# Altium project phun_suong.PrjPcb
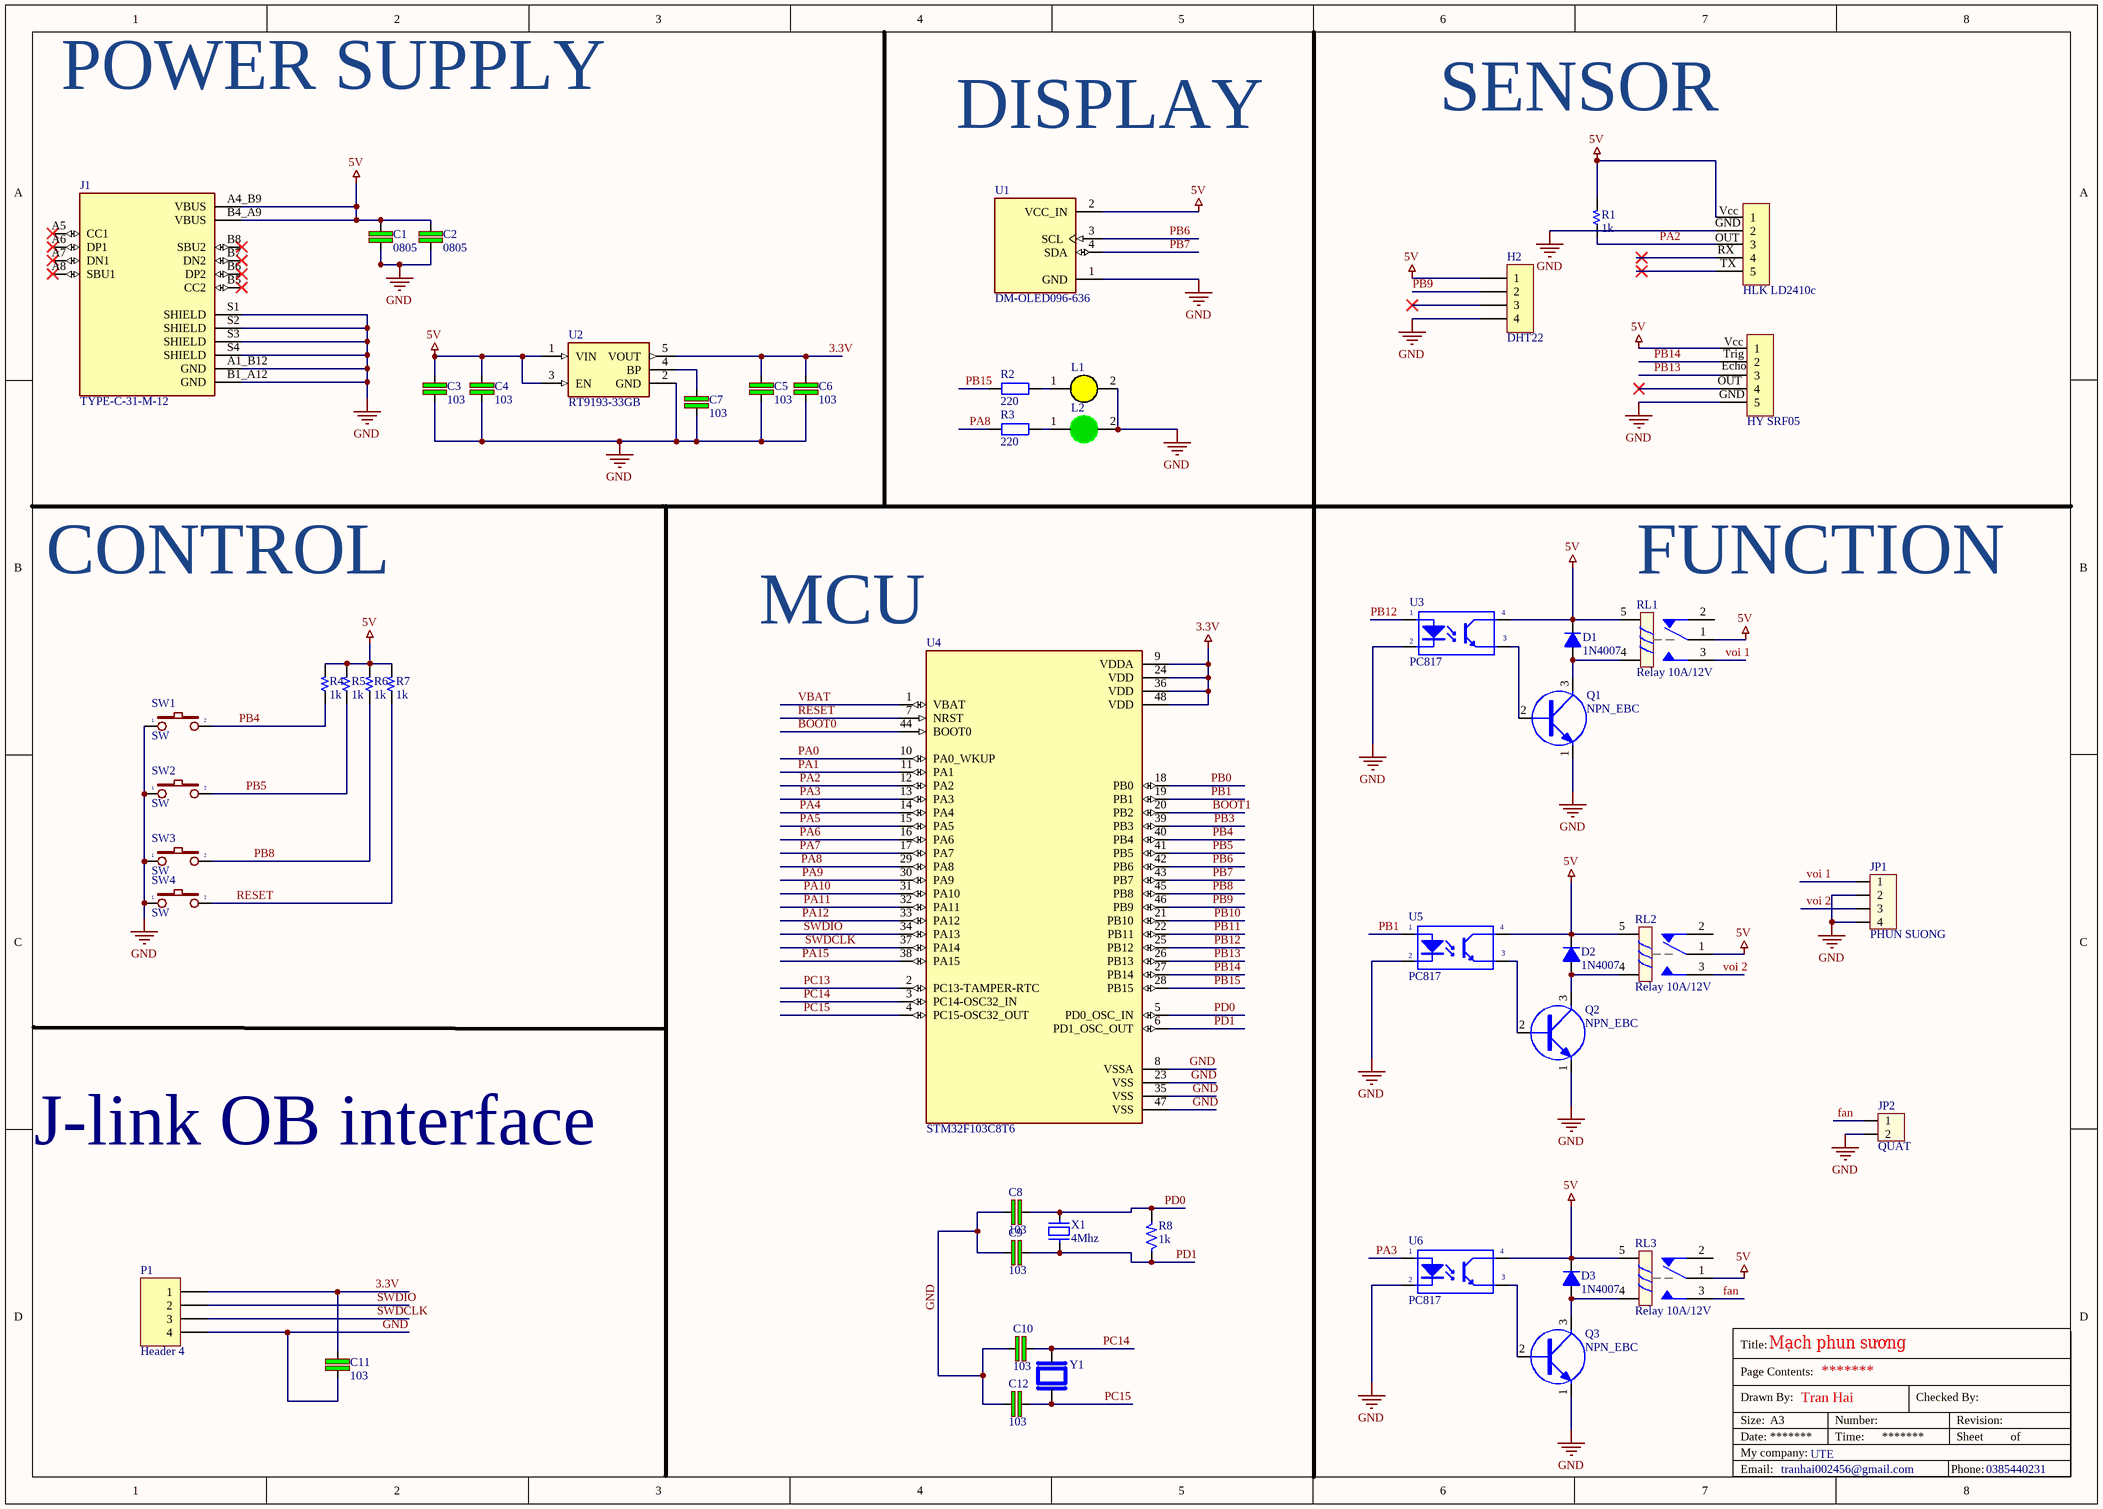
[diagram p0: main.SchDoc]
1 sheet, 50 parts. Net scope: global (net labels, ports and power ports of the same name join across sheets).
Board files: PCB1.PcbDoc, PCB2.PcbDoc, PCB3.PcbDoc, PCB4.PcbDoc

## Sheet main.SchDoc: Title
size A3; Date: *******; ApprovedBy: *******; CheckedBy: None; Author: *******; CompanyName: *******; DrawnBy: Name; Engineer: *******; Organization: *******; Address1: *******; Address2: *******; Address3: *******; Address4: *******; DocumentNumber: Doc Num; Revision: *******; SheetNumber: 1; SheetTotal: 1; CurrentTime: *******; CurrentDate: *******; Time: *******; DocumentFullPathAndName: *******; DocumentName: *******; ModifiedDate: *******; ImagePath: *******; ProjectName: *******; Application_BuildNumber: *******

### Parts
C1  0805  [C-0805]
C2  0805  [C-0805]
C3  103  [C-0805]
C4  103  [C-0805]
C5  103  [C-0805]
C6  103  [C-0805]
C7  103  [C-0805]
C8  103  [C-0805]
C9  103  [C-0805]
C10  103  [C-0805]
C11  103  [C-0805]
C12  103  [C-0805]
D1  1N4007  [D1A]
D2  1N4007  [D1A]
D3  1N4007  [D1A]
H1  HLK LD2410c  [Header 5P DC 2.54]
H2  DHT22  [XH2.54M-4]
H3  HY SRF05  [XH2.54M-5]
J1  TYPE-C-31-M-12  [HRO_TYPE-C-31-M-12]
JP1  PHUN SUONG  [CON4]
JP2  QUAT  [CON2]
L1  LED 0805  [LED-0805-Yellow]  (value not drawn)
L2  LED 0805  [LED-0805-Green]  (value not drawn)
P1  Header 4  [HDR1X4]
Q1  NPN_EBC  [QTO-92]
Q2  NPN_EBC  [QTO-92]
Q3  NPN_EBC  [QTO-92]
R1  1k  [TRO SMD 0603]
R2  220  [tro smd 0603]
R3  220  [tro smd 0603]
R4  1k  [TRO SMD 0603]
R5  1k  [TRO SMD 0603]
R6  1k  [TRO SMD 0603]
R7  1k  [TRO SMD 0603]
R8  1k  [SM-1206]
RL1  Relay 10A/12V  [RL_SPDT_10A]
RL2  Relay 10A/12V  [RL_SPDT_10A]
RL3  Relay 10A/12V  [RL_SPDT_10A]
SW1  SW  [SW2]
SW2  SW  [SW2]
SW3  SW  [SW2]
SW4  SW  [SW2]
U1  DM-OLED096-636  [MODULE_DM-OLED096-636]
U2  RT9193-33GB  [SOT94P279X129-5N]
U3  PC817  [DIP4/W0.3]
U4  STM32F103C8T6  [QFP50P900X900X160-48N]
U5  PC817  [DIP4/W0.3]
U6  PC817  [DIP4/W0.3]
X1  4Mhz  [XT2]
Y1  ABS07-32.768KHZ-T  [XTAL_ABS07-32.768KHZ-T]  (value not drawn)

### Nets
3.3V: C5.2 C6.2 C11.2 P1.1 U2.5(VOUT) U4.9(VDDA) U4.24(VDD) U4.36(VDD) U4.48(VDD)
5V: C1.2 C2.2 C3.2 C4.2 D1.2(K) D2.2(K) D3.2(K) H1.1 H2.1 H3.1 J1.A4_B9(VBUS) J1.B4_A9(VBUS) R1.2 R4.2 R5.2 R6.2 R7.2 RL1.1 RL1.5 RL2.1 RL2.5 RL3.1 RL3.5 U1.2(VCC_IN) U2.1(VIN) U2.3(EN) U3.4(C) U5.4(C) U6.4(C)
GND: C1.1 C2.1 C3.1 C4.1 C5.1 C6.1 C7.1 C8.1 C9.1 C10.1 C11.1 C12.1 H1.2 H2.4 H3.5 J1.A1_B12(GND) J1.B1_A12(GND) J1.S1(SHIELD) J1.S2(SHIELD) J1.S3(SHIELD) J1.S4(SHIELD) JP1.2 JP1.4 JP2.2 L1.2(K) L2.2(K) P1.4 Q1.1(E) Q2.1(E) Q3.1(E) SW1.1 SW2.1 SW3.1 SW4.1 U1.1(GND) U2.2(GND) U3.2(K) U4.8(VSSA) U4.23(VSS) U4.35(VSS) U4.47(VSS) U5.2(K) U6.2(K)
BOOT0: U4.44(BOOT0)
BOOT1: U4.20(PB2)
fan: JP2.1 RL3.3
PA0: U4.10(PA0_WKUP)
PA1: U4.11(PA1)
PA2: H1.3 R1.1 U4.12(PA2)
PA3: U4.13(PA3) U6.1(A)
PA4: U4.14(PA4)
PA5: U4.15(PA5)
PA6: U4.16(PA6)
PA7: U4.17(PA7)
PA8: R3.1 U4.29(PA8)
PA9: U4.30(PA9)
PA10: U4.31(PA10)
PA11: U4.32(PA11)
PA12: U4.33(PA12)
PA15: U4.38(PA15)
PB0: U4.18(PB0)
PB1: U4.19(PB1) U5.1(A)
PB3: U4.39(PB3)
PB4: R4.1 SW1.2 U4.40(PB4)
PB5: R5.1 SW2.2 U4.41(PB5)
PB6: U1.3(SCL) U4.42(PB6)
PB7: U1.4(SDA) U4.43(PB7)
PB8: R6.1 SW3.2 U4.45(PB8)
PB9: H2.2 U4.46(PB9)
PB10: U4.21(PB10)
PB11: U4.22(PB11)
PB12: U3.1(A) U4.25(PB12)
PB13: H3.3 U4.26(PB13)
PB14: H3.2 U4.27(PB14)
PB15: R2.1 U4.28(PB15)
PC13: U4.2(PC13-TAMPER-RTC)
PC14: C10.2 U4.3(PC14-OSC32_IN) Y1.2
PC15: C12.2 U4.4(PC15-OSC32_OUT) Y1.1
PD0: C8.2 R8.2 U4.5(PD0_OSC_IN) X1.1
PD1: C9.2 R8.1 U4.6(PD1_OSC_OUT) X1.2
RESET: R7.1 SW4.2 U4.7(NRST)
SWDCLK: P1.3 U4.37(PA14)
SWDIO: P1.2 U4.34(PA13)
VBAT: U4.1(VBAT)
voi 1: JP1.1 RL1.3
voi 2: JP1.3 RL2.3
NetC7_2: C7.2 U2.4(BP)
NetD1_1: D1.1(A) Q1.3(C) RL1.4
NetD2_1: D2.1(A) Q2.3(C) RL2.4
NetD3_1: D3.1(A) Q3.3(C) RL3.4
NetL1_1: L1.1(A) R2.2
NetL2_1: L2.1(A) R3.2
NetQ1_2: Q1.2(B) U3.3(E)
NetQ2_2: Q2.2(B) U5.3(E)
NetQ3_2: Q3.2(B) U6.3(E)

Not connected (* = marked no-connect by the designer): H1 4* 5*; H2 3*; H3 4*; J1 A5(CC1)* A6(DP1)* A7(DN1)* A8(SBU1)* B5(CC2)* B6(DP2)* B7(DN2)* B8(SBU2)*; RL1 2; RL2 2; RL3 2

### Notes on the sheet
- POWER SUPPLY
- DISPLAY
- SENSOR
- (near H1) GND
- (near H1) OUT
- (near H1) Vcc
- (near H1) RX
- (near H1) TX
- (near H3) OUT
- (near H3) Echo
- (near H3) Trig
- (near H3) Vcc
- (near H3) GND
- CONTROL
- (near RL1) FUNCTION
- MCU
- J-link OB interface
- Mạch phun sương
- Title:
- Page Contents:
- Size:
- Date:
- Drawn By:
- My company:
- Email:
- A3
- tranhai002456@gmail.com
- Tran Hai
- UTE
- Number:
- Time:
- Checked By:
- Phone:
- Revision:
- Sheet
- 0385440231
- of

### Library data of the parts
C1 C2 = C: Cap SMD; Value: 103
C3-C12 = C: Cap SMD; Value: 103
D1-D3 = D1A: Diode 1A; Value: 1N4007
H1 = Header 5P 2.54 Duc Cong: Cắm; Ten_Linh_Kien: Header 5P XH2.54-5P Đực Cong; Don_Vi: Con; Ma_Hang: MH001308; Chung_Loai: Cắm
H2 = Header 4P 2.54 Duc Thang: Cắm; Ten_Linh_Kien: Header 4P XH2.54-4P Đực Thẳng; Don_Vi: Con; Ma_Hang: MH001285; Chung_Loai: Cắm
H3 = Header 5P 2.54 Duc Thang: Cắm; Ten_Linh_Kien: Header 5P XH2.54-5P Đực Thẳng; Don_Vi: Con; Ma_Hang: MH001298; Chung_Loai: Cắm
J1 = TYPE-C-31-M-12: USB Connectors 24 Receptacle 1 8.94*7.3mm RoHS; MF: HRO Electronics Co., Ltd.; Price: None; Value: *; SnapEDA_Link: https://www.snapeda.com/parts/TYPE-C-31-M-12/HRO+Electronics+Co.%252C+Ltd./view-part/?ref=snap; Package: Package; Availability: Not in stock; Check_prices: https://www.snapeda.com/parts/TYPE-C-31-M-12/HRO+Electronics+Co.%252C+Ltd./view-part/?ref=eda; MP: TYPE-C-31-M-12
JP1 = Con4: Connector 4; Value: Connector 4
JP2 = Con2: Connector 2; Value: Connector 2
L1 = LED 0805 Vang: Dán; Don_Vi: Con; Ma_Hang: MH002329; Ten_Linh_Kien: LED 0805 Màu Vàng ( Yellow); Ghi_Chu: *; Kieu_Chan: *; Chung_Loai: Dán
L2 = LED 0805 Xanh La: Dán; Don_Vi: Con; Ma_Hang: MH002326; Ten_Linh_Kien: LED 0805 Màu Xanh Lá (Green); Ghi_Chu: *; Kieu_Chan: *; Chung_Loai: Dán
P1 = Header 4: Header, 4-Pin; LatestRevisionDate: 17-Jul-2002; LatestRevisionNote: Re-released for DXP Platform.; Publisher: Altium Limited
Q1-Q3 = NPN_EBC: NPN Transistor
R1 R4-R7 = Res_0603
R2 R3 = Tro 0603 1% 0R: Dán; Don_Vi: Con; So_Chan: 2; Ten_Linh_Kien: Trở 0603 1% 0R; Ma_Hang: MH005792; Chung_Loai: Dán; Kieu_Chan: *
R8 = R: Resistor 1/4W; Value: R1/4W - 1K
RL1-RL3 = Relay 1: Relay SPDT,10A - 12VDC 5 Pin; Value: Relay SPDT, 10A, 12V
SW1-SW4 = SW2: Switch button 2 pin; Value: SW chip 2 pin
U1 = DM-OLED096-636: 0.96â€ 128 X 64 MONOCHROME GRAPHIC OLED DISPLAY MODULE - I2C; SnapEDA_Link: https://www.snapeda.com/parts/DM-OLED096-636/Display+Module/view-part/?ref=snap; Package: Package; Value: *; MF: Display Module; MP: DM-OLED096-636; Check_prices: https://www.snapeda.com/parts/DM-OLED096-636/Display+Module/view-part/?ref=eda
U2 = RT9193-33GB: Linear Voltage Regulator IC Positive Fixed 1 Output 300mA TSOT-23-5; MF: Richtek USA; SnapEDA_Link: https://www.snapeda.com/parts/RT9193-33GB/Richtek+USA+Inc./view-part/?ref=snap; Package: SOT-23-5 Richtek; MP: RT9193-33GB; Check_prices: https://www.snapeda.com/parts/RT9193-33GB/Richtek+USA+Inc./view-part/?ref=eda; Purchase-URL: https://pricing.snapeda.com/search/part/RT9193-33GB/?ref=eda; Digi-Key_Part_Number: 1028-1014-2-ND; Value: *
U3 U5 U6 = PC817: Single Opto; Value: PC817
U4 = STM32F103C8T6: ARM® Cortex®-M3 STM32F1 Microcontroller IC 32-Bit 72MHz 64KB (64K x 8) FLASH 48-LQFP (7x7); MF: STMicroelectronics; SnapEDA_Link: https://www.snapeda.com/parts/STM32F103C8T6/STMicroelectronics/view-part/?ref=snap; Package: LQFP-48 STMicroelectronics; Value: *; MP: STM32F103C8T6; Check_prices: https://www.snapeda.com/parts/STM32F103C8T6/STMicroelectronics/view-part/?ref=eda
X1 = XT2: Crystal For all Crystal 2pin.; Value: 4Mhz
Y1 = ABS07-32.768KHZ-T: 32.768 kHz Â±20ppm Crystal 12.5pF 70 kOhms 2-SMD, No Lead; MF: Abracon; Availability: In Stock; SnapEDA_Link: https://www.snapeda.com/parts/ABS07-32.768KHZ-T/Abracon+LLC/view-part/?ref=snap; MP: ABS07-32.768KHZ-T; Price: None; Value: *; Check_prices: https://www.snapeda.com/parts/ABS07-32.768KHZ-T/Abracon+LLC/view-part/?ref=eda; Purchase-URL: https://pricing.snapeda.com/search/part/ABS07-32.768KHZ-T/?ref=eda; Package: SMD-2 Abracon LLC